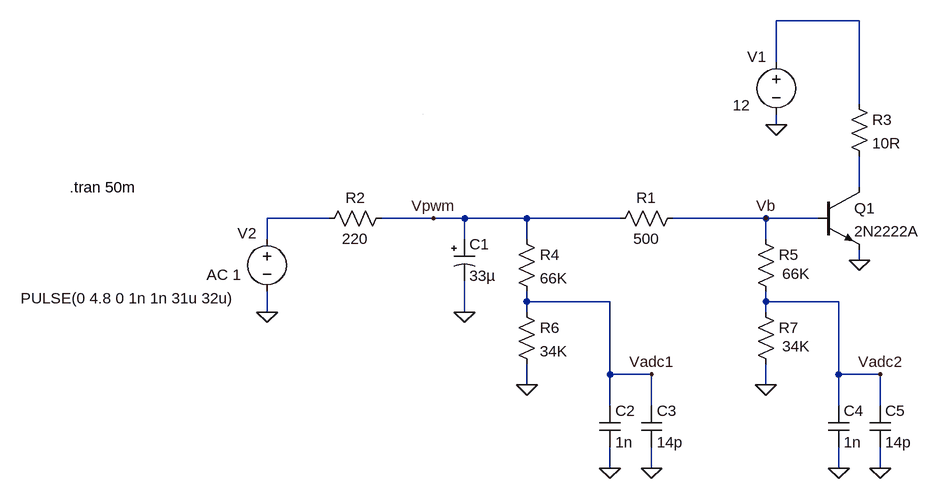
[diagram p0: schematic Arduino PWM Analysis.asc]
Arduino PWM Analysis.asc, the LTspice schematic file:
Version 4
SHEET 1 880 680
WIRE 672 -144 544 -144
WIRE 544 -80 544 -144
WIRE 672 -16 672 -144
WIRE 544 16 544 0
WIRE 672 112 672 64
WIRE -144 160 -240 160
WIRE 16 160 -64 160
WIRE 64 160 16 160
WIRE 160 160 64 160
WIRE 304 160 160 160
WIRE 528 160 384 160
WIRE 608 160 528 160
WIRE -240 192 -240 160
WIRE 64 192 64 160
WIRE 160 192 160 160
WIRE 528 192 528 160
WIRE 672 224 672 208
WIRE 160 288 160 272
WIRE 288 288 160 288
WIRE 528 288 528 272
WIRE 640 288 528 288
WIRE -240 304 -240 272
WIRE 64 304 64 256
WIRE 160 304 160 288
WIRE 528 304 528 288
WIRE 288 400 288 288
WIRE 352 400 288 400
WIRE 640 400 640 288
WIRE 704 400 640 400
WIRE 160 416 160 384
WIRE 528 416 528 384
WIRE 288 448 288 400
WIRE 352 448 352 400
WIRE 640 448 640 400
WIRE 704 448 704 400
WIRE 288 544 288 512
WIRE 352 544 352 512
WIRE 640 544 640 512
WIRE 704 544 704 512
WIRE 0 0 0 0
FLAG -240 304 0
FLAG 544 16 0
FLAG 672 224 0
FLAG 64 304 0
FLAG 160 416 0
FLAG 528 416 0
FLAG 288 544 0
FLAG 352 544 0
FLAG 640 544 0
FLAG 704 544 0
FLAG 352 400 Vadc1
FLAG 704 400 Vadc2
FLAG 16 160 Vpwm
FLAG 528 160 Vb
SYMBOL res -48 144 R90
WINDOW 0 0 56 VBottom 2
WINDOW 3 32 56 VTop 2
SYMATTR InstName R2
SYMATTR Value 220
SYMBOL voltage -240 176 R0
WINDOW 0 -45 7 Left 2
WINDOW 3 -379 107 Left 2
WINDOW 123 -93 71 Left 2
WINDOW 39 0 0 Left 2
SYMATTR InstName V2
SYMATTR Value PULSE(0 4.8 0 1n 1n 31u 32u)
SYMATTR Value2 AC 1
SYMBOL polcap 48 192 R0
WINDOW 3 24 56 Left 2
SYMATTR Value 33µ
SYMATTR InstName C1
SYMATTR Description Capacitor
SYMATTR Type cap
SYMATTR SpiceLine V=50 Irms=25m Rser=6.7 Lser=0
SYMBOL res 400 144 R90
WINDOW 0 0 56 VBottom 2
WINDOW 3 32 56 VTop 2
SYMATTR InstName R1
SYMATTR Value 500
SYMBOL npn 608 112 R0
SYMATTR InstName Q1
SYMATTR Value 2N2222A
SYMBOL voltage 544 -96 R0
WINDOW 0 -45 7 Left 2
WINDOW 3 -67 82 Left 2
WINDOW 123 -93 71 Left 2
WINDOW 39 0 0 Left 2
SYMATTR InstName V1
SYMATTR Value 12
SYMBOL res 656 -32 R0
SYMATTR InstName R3
SYMATTR Value 10R
SYMBOL res 144 176 R0
SYMATTR InstName R4
SYMATTR Value 66K
SYMBOL res 512 176 R0
WINDOW 3 41 69 Left 2
SYMATTR InstName R5
SYMATTR Value 66K
SYMBOL res 144 288 R0
SYMATTR InstName R6
SYMATTR Value 34K
SYMBOL res 512 288 R0
WINDOW 3 41 69 Left 2
SYMATTR InstName R7
SYMATTR Value 34K
SYMBOL cap 272 448 R0
SYMATTR InstName C2
SYMATTR Value 1n
SYMBOL cap 336 448 R0
SYMATTR InstName C3
SYMATTR Value 14p
SYMBOL cap 624 448 R0
SYMATTR InstName C4
SYMATTR Value 1n
SYMBOL cap 688 448 R0
SYMATTR InstName C5
SYMATTR Value 14p
TEXT -544 112 Left 2 !.tran 50m

The netlist it stands for:
* Arduino PWM Analysis.asc
R2 Vpwm N003 220
V2 N003 0 PULSE(0 4.8 0 1n 1n 31u 32u) AC 1
C1 Vpwm 0 33µ V=50 Irms=25m Rser=6.7 Lser=0
R1 Vb Vpwm 500
Q1 N002 Vb 0 0 2N2222A
V1 N001 0 12
R3 N001 N002 10R
R4 Vpwm Vadc1 66K
R5 Vb Vadc2 66K
R6 Vadc1 0 34K
R7 Vadc2 0 34K
C2 Vadc1 0 1n
C3 Vadc1 0 14p
C4 Vadc2 0 1n
C5 Vadc2 0 14p
.model NPN NPN
.model PNP PNP
.lib standard.bjt
.tran 50m
.backanno
.end